# Altium schematic sheet sensors.SchDoc
size A
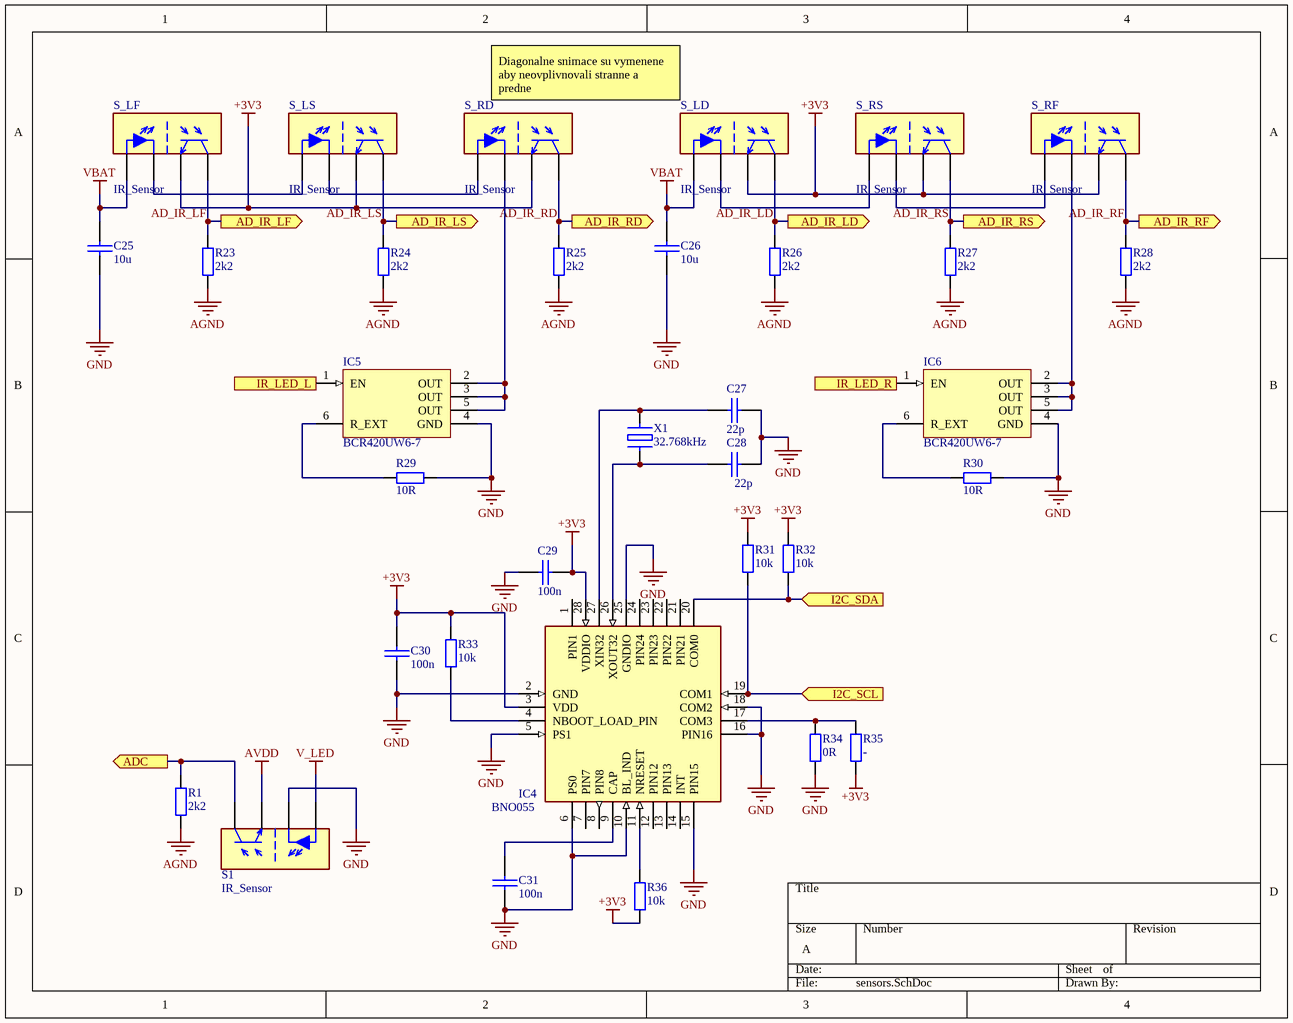
[diagram p0: sensors.SchDoc]

## Parts
C25  10u  [C0805_Paste]
C26  10u  [C0805_Paste]
C27  22p  [C0402-Paste]
C28  22p  [C0402-Paste]
C29  100n  [C0402-Paste]
C30  100n  [C0402-Paste]
C31  100n  [C0402-Paste]
IC4  BNO055  [BNO055]
IC5  Manufacturer Part Number 1: BCR420UW6-7  [SOT-23-6]  (hidden comment: *)
IC6  Manufacturer Part Number 1: BCR420UW6-7  [SOT-23-6]  (hidden comment: *)
R1  2k2  [R0402-Paste]
R23  2k2  [R0402-Paste]
R24  2k2  [R0402-Paste]
R25  2k2  [R0402-Paste]
R26  2k2  [R0402-Paste]
R27  2k2  [R0402-Paste]
R28  2k2  [R0402-Paste]
R29  10R  [R0805_PASTE]
R30  10R  [R0805_PASTE]
R31  10k  [R0402-Paste]
R32  10k  [R0402-Paste]
R33  10k  [R0402-Paste]
R34  0R  [R0402-Paste]
R35  -  [R0402-Paste]
R36  10k  [R0402-Paste]
S1  IR_Sensor  [IR_Sensor]
S_LD  IR_Sensor  [IR_Sensor]
S_LF  IR_Sensor  [IR_Sensor]
S_LS  IR_Sensor  [IR_Sensor]
S_RD  IR_Sensor  [IR_Sensor]
S_RF  IR_Sensor  [IR_Sensor]
S_RS  IR_Sensor  [IR_Sensor]
X1  32.768kHz  [CM250C]

## Ports
AD_IR_LD (out), AD_IR_LF (out), AD_IR_LS (out), AD_IR_RD (out), AD_IR_RF (out), AD_IR_RS (out), ADC (out), I2C_SCL (in), I2C_SDA (in), IR_LED_L (in), IR_LED_R (in)

## Nets
+3V3: C29.2 C30.1 IC4.3(VDD) IC4.28(VDDIO) R31.1 R32.1 R33.1 R35.2 R36.2 S_LD.DwR(TRANSCEIVER_C) S_LF.DwR(TRANSCEIVER_C) S_LS.DwR(TRANSCEIVER_C) S_RD.DwR(TRANSCEIVER_C) S_RF.DwR(TRANSCEIVER_C) S_RS.DwR(TRANSCEIVER_C)
AGND: R1.2 R23.2 R24.2 R25.2 R26.2 R27.2 R28.2
AVDD: S1.DwR(TRANSCEIVER_C)
GND: C25.2 C26.2 C27.2 C28.2 C29.1 C30.2 C31.2 IC4.2(GND) IC4.5(PS1) IC4.6(PS0) IC4.10(BL_IND) IC4.15(PIN15) IC4.16(PIN16) IC4.18(COM2) IC4.25(GNDIO) IC5.4(GND) IC6.4(GND) R29.2 R30.2 R34.2 S1.TopR(LED_K)
V_LED: S1.TopL(LED_A)
VBAT: C25.1 C26.1 S_LD.TopL(LED_A) S_LF.TopL(LED_A)
AD_IR_LD: R26.1 S_LD.DwL(TRANSCEIVER_E) ; port AD_IR_LD
AD_IR_LF: R23.1 S_LF.DwL(TRANSCEIVER_E) ; port AD_IR_LF
AD_IR_LS: R24.1 S_LS.DwL(TRANSCEIVER_E) ; port AD_IR_LS
AD_IR_RD: R25.1 S_RD.DwL(TRANSCEIVER_E) ; port AD_IR_RD
AD_IR_RF: R28.1 S_RF.DwL(TRANSCEIVER_E) ; port AD_IR_RF
AD_IR_RS: R27.1 S_RS.DwL(TRANSCEIVER_E) ; port AD_IR_RS
ADC: R1.1 S1.DwL(TRANSCEIVER_E) ; port ADC
I2C_SCL: IC4.19(COM1) R31.2 ; port I2C_SCL
I2C_SDA: IC4.20(COM0) R32.2 ; port I2C_SDA
IR_LED_L: IC5.1(EN) ; port IR_LED_L
IR_LED_R: IC6.1(EN) ; port IR_LED_R
NetC27_1: C27.1 IC4.27(XIN32) X1.4
NetC28_1: C28.1 IC4.26(XOUT32) X1.1
NetC31_1: C31.1 IC4.9(CAP)
NetIC4_4: IC4.4(NBOOT_LOAD_PIN) R33.2
NetIC4_11: IC4.11(NRESET) R36.1
NetIC4_17: IC4.17(COM3) R34.1 R35.1
NetIC5_2: IC5.2(OUT) IC5.3(OUT) IC5.5(OUT) S_RD.TopR(LED_K)
NetIC5_6: IC5.6(R_EXT) R29.1
NetIC6_2: IC6.2(OUT) IC6.3(OUT) IC6.5(OUT) S_RF.TopR(LED_K)
NetIC6_6: IC6.6(R_EXT) R30.1
NetS_LD_TopR: S_LD.TopR(LED_K) S_RS.TopL(LED_A)
NetS_LF_TopR: S_LF.TopR(LED_K) S_LS.TopL(LED_A)
NetS_LS_TopR: S_LS.TopR(LED_K) S_RD.TopL(LED_A)
NetS_RF_TopL: S_RF.TopL(LED_A) S_RS.TopR(LED_K)

Not connected (* = marked no-connect by the designer): IC4 1(PIN1) 7(PIN7) 8(PIN8) 12(PIN12) 13(PIN13) 14(INT) 21(PIN21) 22(PIN22) 23(PIN23) 24(PIN24)

## Notes on the sheet
- Diagonalne snimace su vymenene aby neovplivnovali stranne a predne

## Library data of the parts
C25 C26 = C-0805: Multilayer Ceramic Capacitors MLCC - SMD 0805; Value: 10u; Manufacturer: -; Manufacturer PN: -; Supplier: digikey.ca
C27-C31 = C-0402: Multilayer Ceramic Capacitors MLCC - SMD  0402; Manufacturer: -; Manufacturer PN: -; Supplier: digikey.ca
  C27 C28: Value: 22p
  C29-C31: Value: 100n
IC4 = BNO055: Integrated Circuit; Manufacturer_Name: Bosch Sensortec; Datasheet Link: https://ae-bst.resource.bosch.com/media/_tech/media/datasheets/BST_BNO055_DS000_14.pdf; Height: 1mm; Manufacturer_Part_Number: BNO055; Mouser Part Number: 262-BNO055; Mouser Price/Stock: https://www.mouser.com/Search/Refine.aspx?Keyword=262-BNO055
IC5 IC6 = BCR420UW6: IC LED DRIVER SOT26; Manufacturer 1: Diodes; Number of Outputs: 1; Max Supply Voltage: 40V; Output Current per Channel: 350mA; Min Output Voltage: 1.4V; Max Output Current: 11mA; Dimming: PWM; Supplier 1: Mouser; Stock 1: 108388; Pricing 1: 1=0.39000, 10=0.29700, 100=0.16100, 1000=0.12100, 3000=0.10400, 9000=0.09800 (USD); RoHS: Yes; Mount: Surface Mount; Case/Package: SOT-23-6; Number of Pins: 6; Min Operating Temperature: -55°C; Max Operating Temperature: 150°C; Packaging: Tape and Reel; Output Voltage: 40V; Max Output Voltage: 40V; Number of Channels: 1; ComponentLink1URL: http://www.mouser.com/ds/2/115/BCR420UW6_BCR421UW6-553387.pdf?src-supplier=Mouser; ComponentLink1Description: http://www.mouser.com/ds/2/115/BCR420UW6_BCR421UW6-553387.pdf?src-supplier=Mouser; ComponentLink2URL: http://www.diodes.com/_files/datasheets/BCR420UW6_BCR421UW6.pdf?src-supplier=Avnet; ComponentLink2Description: http://www.diodes.com/_files/datasheets/BCR420UW6_BCR421UW6.pdf?src-supplier=Avnet; ComponentLink3URL: https://www.diodes.com/assets/Datasheets/BCR420UW6-BCR421UW7.pdf?src-supplier=Digi-Key; ComponentLink3Description: https://www.diodes.com/assets/Datasheets/BCR420UW6-BCR421UW7.pdf?src-supplier=Digi-Key; Parameter 1: *; Parameter 2: *; Parameter 3: *; Parameter 4: *; Supplier Part Number 1: 621-BCR420UW6-7; Parameter 5: *; Parameter 6: *; Parameter 7: *; Parameter 8: *; Parameter 9: *; Parameter 10: *; Parameter 11: *; Parameter 12: *; Parameter 13: *; Parameter 14: *; Parameter 15: *; Parameter 16: *; Parameter 17: *; Parameter 18: *
R1 R23-R28 R31-R36 = R-0402: RES SMD 0402; Manufacturer: -; Manufacturer PN: -; Supplier: digikey.ca
  R1 R23-R28: Value: 2k2
  R31-R33 R36: Value: 10k
  R34: Value: 0R
  R35: Value: -
R29 R30 = R-0805: RES SMD 0805; Value: 10R; Manufacturer: -; Manufacturer PN: -; Supplier: digikey.ca
X1 = Xtal: CRYSTAL; Manufacturer PN: CM250C100000AZFT; Manufacturer: Citizen Finedevice Co Ltd; Value: 32.768kHz; Supplier: digikey.ca
S1 S_LD S_LF S_LS S_RD S_RF S_RS = IR_Sensor: Terminal pitch: 2.54mm